# EAGLE design RILey_Schematic (EAGLE 9.6.2)
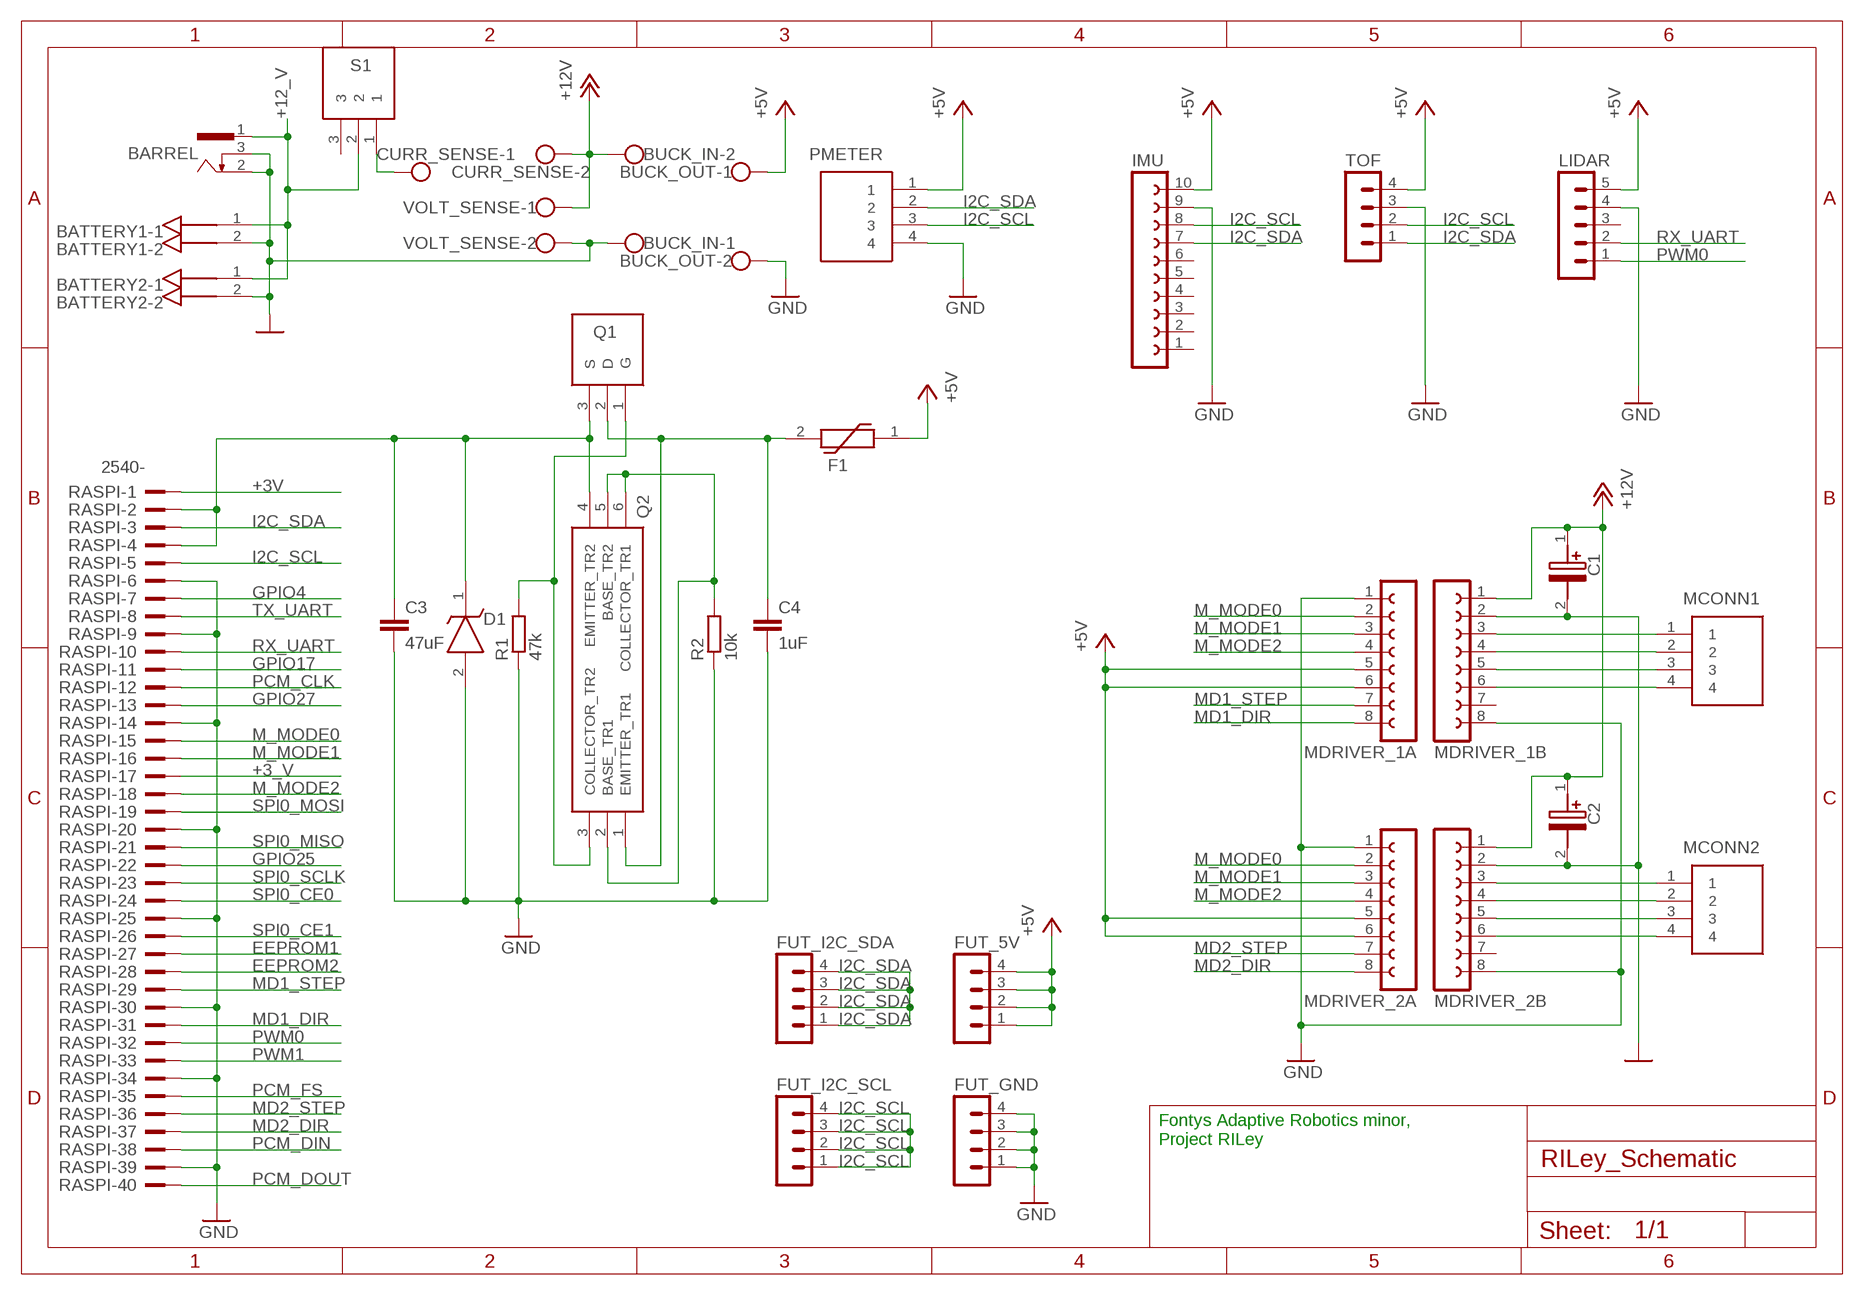
[diagram p0: schematic, sheet 1]

## Parts
BARREL  733980-62  [733980-62]
BATTERY1  0026604020  [KK41791-4020_2-PIN]
BATTERY2  0026604020  [KK41791-4020_2-PIN]
BUCK_IN  W237-102  [W237-102]
BUCK_OUT  W237-102  [W237-102]
C1  100uF  UPS1E101MED  [CAPPRD250W50D655H1250]
C2  100uF  UPS1E101MED  [CAPPRD250W50D655H1250]
C3  47uF  C5/2.5  [C5B2.5]
C4  1uF  C2,5-3  [C2.5-3]
CURR_SENSE  W237-102  [W237-102]
D1  SA5.0A-E3_54  [DIOAD1910W86L670D310]
F1  PTS18126V260  [FUSC4632X90N]
FUT_5V  MA04-1  [MA04-1]
FUT_GND  MA04-1  [MA04-1]
FUT_I2C_SCL  MA04-1  [MA04-1]
FUT_I2C_SDA  MA04-1  [MA04-1]
IMU  FE10-1  [FE10]
LIDAR  MA05-1  [MA05-1]
MCONN1  B4B-XH-A_LF__SN_  [SHDR4W64P0X250_1X4_1240X575X70]
MCONN2  B4B-XH-A_LF__SN_  [SHDR4W64P0X250_1X4_1240X575X70]
MDRIVER_1A  FE08-1  [FE08]
MDRIVER_1B  FE08-1  [FE08]
MDRIVER_2A  FE08-1  [FE08]
MDRIVER_2B  FE08-1  [FE08]
PMETER  BLG1X4  [RHDR4W64P0X254_1X4_1066X250X86]
Q1  IRF9530NPBF  [TO254P469X1042X1967-3P]
Q2  BCM857BS,115  [SOT65P210X110-6N]
R1  47k  R-EU_0207/10  [0207/10]
R2  10k  R-EU_0207/10  [0207/10]
RASPI  2540-  [PAK100/2500-40]
S1  1101M2S3CQE2  [1000-SERIES(SPDT)]
TOF  MA04-1  [MA04-1]
VOLT_SENSE  W237-102  [W237-102]

## Nets
0V [Power]: BARREL.2 BARREL.3 BATTERY1.2 BATTERY2.2 BUCK_IN.1 C1.2(-) C2.2(-) MDRIVER_1B.2 MDRIVER_2B.2 VOLT_SENSE.2
+3_V: RASPI.17
+3V: RASPI.1
+5V [Power]: BUCK_OUT.1 F1.1 FUT_5V.1 FUT_5V.2 FUT_5V.3 FUT_5V.4 IMU.10 LIDAR.5 MDRIVER_1A.5 MDRIVER_1A.6 MDRIVER_2A.5 MDRIVER_2A.6 PMETER.1 TOF.4
+12_V [Power]: BARREL.1 BATTERY1.1 BATTERY2.1 S1.2
+12V [Power]: BUCK_IN.2 C1.1(+) C2.1(+) CURR_SENSE.2 MDRIVER_1B.1 MDRIVER_2B.1 VOLT_SENSE.1
EEPROM1: RASPI.27
EEPROM2: RASPI.28
GND [Power]: BUCK_OUT.2 C3.2 C4.2 D1.2(A) FUT_GND.1 FUT_GND.2 FUT_GND.3 FUT_GND.4 IMU.9 LIDAR.4 MDRIVER_1A.1 MDRIVER_1B.8 MDRIVER_2A.1 MDRIVER_2B.8 PMETER.4 R1.1 R2.1 RASPI.6 RASPI.9 RASPI.14 RASPI.20 RASPI.25 RASPI.30 RASPI.34 RASPI.39 TOF.3
GPIO4: RASPI.7
GPIO17: RASPI.11
GPIO25: RASPI.22
GPIO27: RASPI.13
I2C_SCL: FUT_I2C_SCL.1 FUT_I2C_SCL.2 FUT_I2C_SCL.3 FUT_I2C_SCL.4 IMU.8 PMETER.3 RASPI.5 TOF.2
I2C_SDA: FUT_I2C_SDA.1 FUT_I2C_SDA.2 FUT_I2C_SDA.3 FUT_I2C_SDA.4 IMU.7 PMETER.2 RASPI.3 TOF.1
M_MODE0: MDRIVER_1A.2 MDRIVER_2A.2 RASPI.15
M_MODE1: MDRIVER_1A.3 MDRIVER_2A.3 RASPI.16
M_MODE2: MDRIVER_1A.4 MDRIVER_2A.4 RASPI.18
MD1_DIR: MDRIVER_1A.8 RASPI.31
MD1_STEP: MDRIVER_1A.7 RASPI.29
MD2_DIR: MDRIVER_2A.8 RASPI.37
MD2_STEP: MDRIVER_2A.7 RASPI.36
N$4 [Power]: MCONN1.1 MDRIVER_1B.3
N$5 [Power]: MCONN1.2 MDRIVER_1B.4
N$6 [Power]: MCONN1.3 MDRIVER_1B.5
N$7 [Power]: MCONN1.4 MDRIVER_1B.6
N$8 [Power]: MCONN2.1 MDRIVER_2B.3
N$9 [Power]: MCONN2.2 MDRIVER_2B.4
N$10 [Power]: MCONN2.3 MDRIVER_2B.5
N$11 [Power]: MCONN2.4 MDRIVER_2B.6
N$12: Q1.1(G) Q2.3(COLLECTOR_TR2) R1.2
N$13 [Power]: CURR_SENSE.1 S1.1
N$14 [Power]: C4.1 F1.2 Q1.2(D) Q2.1(EMITTER_TR1)
N$15 [Power]: C3.1 D1.1(K) Q1.3(S) Q2.4(EMITTER_TR2) RASPI.2 RASPI.4
N$16: Q2.2(BASE_TR1) Q2.5(BASE_TR2) Q2.6(COLLECTOR_TR1) R2.2
PCM_CLK: RASPI.12
PCM_DIN: RASPI.38
PCM_DOUT: RASPI.40
PCM_FS: RASPI.35
PWM0: LIDAR.1 RASPI.32
PWM1: RASPI.33
RX_UART: LIDAR.2 RASPI.10
SPI0_CE0: RASPI.24
SPI0_CE1: RASPI.26
SPI0_MISO: RASPI.21
SPI0_MOSI: RASPI.19
SPI0_SCLK: RASPI.23
TX_UART: RASPI.8
Unconnected: IMU.1 IMU.2 IMU.3 IMU.4 IMU.5 IMU.6 LIDAR.3 MDRIVER_1B.7 MDRIVER_2B.7 S1.3

## Notes on the sheet
- Fontys Adaptive Robotics minor,
  Project RILey

## Library data of the parts
BARREL = con-conrad:73398?: FEMALE PRINT CONNECTOR Niedervolt-Steckverbinder Distributor Conrad
BATTERY1 BATTERY2 = molex:0026604020: KK® 396 Header, Vertical, Friction Lock, 2 Circuits, Tin (Sn) Plating KK® Interconnect System Documentation Drawing <http://www.molex.com/pdm_docs/sd/026604020_sd.pdf>; CATEGORY: Connectors, Interconnects; COLOR: Natural; CONNECTOR_TYPE: Header, Unshrouded; CONTACT_FINISH: Tin; CONTACT_FINISH_THICKNESS: 60µin (1.52µm); CONTACT_MATING_LENGTH: 0.450" (11.43mm); CONTACT_TYPE: Male Pin; DESCRIPTION: CONN HEADER 2POS .156 VERT TIN; DOCUMENTATION_LINK: <a href="http://www.molex.com/pdm_docs/sd/026604020_sd.pdf">Datasheet</a>; DOCUMENTATION_URL: http://www.molex.com/pdm_docs/sd/026604020_sd.pdf; FAMILY: Rectangular Connectors - Headers, Male Pins; FASTENING_TYPE: Friction Lock; FEATURES: -; MANUFACTURER: Molex Inc; MOUNTING_TYPE: Through Hole; NUMBER_OF_POSITIONS: 2; NUMBER_OF_POSITIONS_LOADED: All; NUMBER_OF_ROWS: 1; PART_NUMBER: 0026604020; PITCH: 0.156" (3.96mm); ROW_SPACING: -; SERIES: KK® 41791; SUPPLIER_ITEM_LINK: <a href="http://www.digikey.com/product-search/en?KeyWords=0026604020&WT.z_header=search_go">Details</a>; SUPPLIER_ITEM_NUMBER: WM4620-ND; SUPPLIER_ITEM_URL: http://www.digikey.com/product-search/en?KeyWords=0026604020&WT.z_header=search_go; SUPPLIER_LINK: <a href="http://www.digikey.com">Home Page</a>; SUPPLIER_NAME: Digi-Key; SUPPLIER_URL: http://www.digikey.com; TERMINATION: Solder
BUCK_IN BUCK_OUT CURR_SENSE VOLT_SENSE = con-wago-500:W237-102: WAGO SCREW CLAMP; MPN: 237-102; OC_FARNELL: unknown; OC_NEWARK: 70K9898
C1 C2 = UPS1E101MED:UPS1E101MED: Al electrolytic cap,PS,25V,100 F Nichicon 100uF 25 V dc Aluminium Electrolytic Capacitor, PS Series 2000h 6.3 (Dia.) x 11mm Source: Datasheet <http://uk.rs-online.com/web/p/products/5194059P>; ALLIED_NUMBER: 70187653; DESCRIPTION: Al electrolytic cap,PS,25V,100 F Nichicon 100uF 25 V dc Aluminium Electrolytic Capacitor, PS Series 2000h 6.3 (Dia.) x 11mm; HEIGHT: 12.5mm; MANUFACTURER_NAME: Nichicon; MANUFACTURER_PART_NUMBER: UPS1E101MED; RS_PART_NUMBER: 5194059P; RS_PRICE-STOCK: http://uk.rs-online.com/web/p/products/5194059P
C3 C4 = capacitor-wima:C: CAPACITOR naming: grid - package width
D1 = SamacSys_Parts:SA5.0A-E3_54: Vishay SA5.0A-E3/54, Uni-Directional TVS Diode, 500W, 2-Pin DO-15 Source: Datasheet <http://uk.rs-online.com/web/p/products/6365527P>; ALLIED_NUMBER: 70217602; DESCRIPTION: Vishay SA5.0A-E3/54, Uni-Directional TVS Diode, 500W, 2-Pin DO-15; HEIGHT: mm; MANUFACTURER_NAME: Vishay; MANUFACTURER_PART_NUMBER: SA5.0A-E3/54; RS_PART_NUMBER: 6365527P; RS_PRICE-STOCK: http://uk.rs-online.com/web/p/products/6365527P
F1 = PTS1812xVxxx:PTS18126V260: PTC Resettable Fuse 2.6A(hold) 5A(trip) 6VDC 100A 1.2W 2.5s 0.015Ohm SMD Solder Pad 1812 T/R Source: Datasheet <https://datasheet.datasheetarchive.com/originals/dk/DKDS41/DSANUWW0021568.pdf>; DESCRIPTION: PTC Resettable Fuse 2.6A(hold) 5A(trip) 6VDC 100A 1.2W 2.5s 0.015Ohm SMD Solder Pad 1812 T/R; HEIGHT: 0.9mm; MANUFACTURER_NAME: Eaton; MANUFACTURER_PART_NUMBER: PTS18126V260
FUT_5V FUT_GND FUT_I2C_SCL FUT_I2C_SDA TOF = con-lstb:MA04-1: PIN HEADER; OC_FARNELL: unknown; OC_NEWARK: unknown
IMU = con-lsta:FE10-1: FEMALE HEADER; OC_FARNELL: unknown; OC_NEWARK: unknown
LIDAR = con-lstb:MA05-1: PIN HEADER; OC_FARNELL: unknown; OC_NEWARK: unknown
MCONN1 MCONN2 = SamacSys_Parts:B4B-XH-A_LF__SN_: XH-2.5mm Header top entry 4 way JST XH Series, Series Number B4B, 2.5mm Pitch 4 Way 1 Row Straight PCB Header, Solder Termination, 3A Source: Datasheet; DESCRIPTION: XH-2.5mm Header top entry 4 way JST XH Series, Series Number B4B, 2.5mm Pitch 4 Way 1 Row Straight PCB Header, Solder Termination, 3A; HEIGHT: 7mm; MANUFACTURER_NAME: JST (JAPAN SOLDERLESS TERMINALS); MANUFACTURER_PART_NUMBER: B4B-XH-A(LF)(SN)
MDRIVER_1A MDRIVER_1B MDRIVER_2A MDRIVER_2B = con-lsta:FE08-1: FEMALE HEADER; OC_FARNELL: unknown; OC_NEWARK: unknown
PMETER = BLG1X4:BLG1X4: Female header 1x4 p straight Source: Datasheet <https://asset.conrad.com/media10/add/160267/c1/-/en/001492285DS01/datasheet-1492285-econ-connect-receptacles-standard-no-of-rows-1-pins-per-row-4-blg1x4-1-pcs.pdf>; DESCRIPTION: Female header 1x4 p straight; HEIGHT: 8.65mm; MANUFACTURER_NAME: Econ Connect; MANUFACTURER_PART_NUMBER: BLG1X4
Q1 = SamacSys_Parts:IRF9530NPBF: MOSFET MOSFT PCh -100V -14A 200mOhm 38.7nC Source: Datasheet <http://china.rs-online.com/web/p/products/2509059275>; ALLIED_NUMBER: 70017011; DESCRIPTION: MOSFET MOSFT PCh -100V -14A 200mOhm 38.7nC; HEIGHT: 4.69mm; MANUFACTURER_NAME: Infineon; MANUFACTURER_PART_NUMBER: IRF9530NPBF; RS_PART_NUMBER: 2509059275; RS_PRICE-STOCK: http://china.rs-online.com/web/p/products/2509059275
Q2 = SamacSys_Parts:BCM857BS,115: Nexperia BCM857BS,115 Dual PNP Transistor, 100 mA, 45 V, 6-Pin UMT Source: Datasheet <http://uk.rs-online.com/web/p/products/0509706>; DESCRIPTION: Nexperia BCM857BS,115 Dual PNP Transistor, 100 mA, 45 V, 6-Pin UMT; HEIGHT: 1.1mm; MANUFACTURER_NAME: Nexperia; MANUFACTURER_PART_NUMBER: BCM857BS,115; RS_PART_NUMBER: 0509706; RS_PRICE-STOCK: http://uk.rs-online.com/web/p/products/0509706
R1 R2 = rcl:R-EU_: RESISTOR, European symbol; SPICEPREFIX: R
RASPI = con-3m:2540-: 3M (TM) Pak 100 4-Wall Header Source: 3M; OC_FARNELL: unknown; OC_NEWARK: unknown
S1 = SamacSys_Parts:1101M2S3CQE2: 1101M2S3CQE2 (Slide Switches) Source: Datasheet <http://uk.rs-online.com/web/p/products/1617340>; ALLIED_NUMBER: 70128282; DESCRIPTION: 1101M2S3CQE2 (Slide Switches); HEIGHT: mm; MANUFACTURER_NAME: C & K COMPONENTS; MANUFACTURER_PART_NUMBER: 1101M2S3CQE2; RS_PART_NUMBER: 1617340; RS_PRICE-STOCK: http://uk.rs-online.com/web/p/products/1617340

## Net classes
1 Power: width 0.508 mm, clearance 0.381 mm

## Board
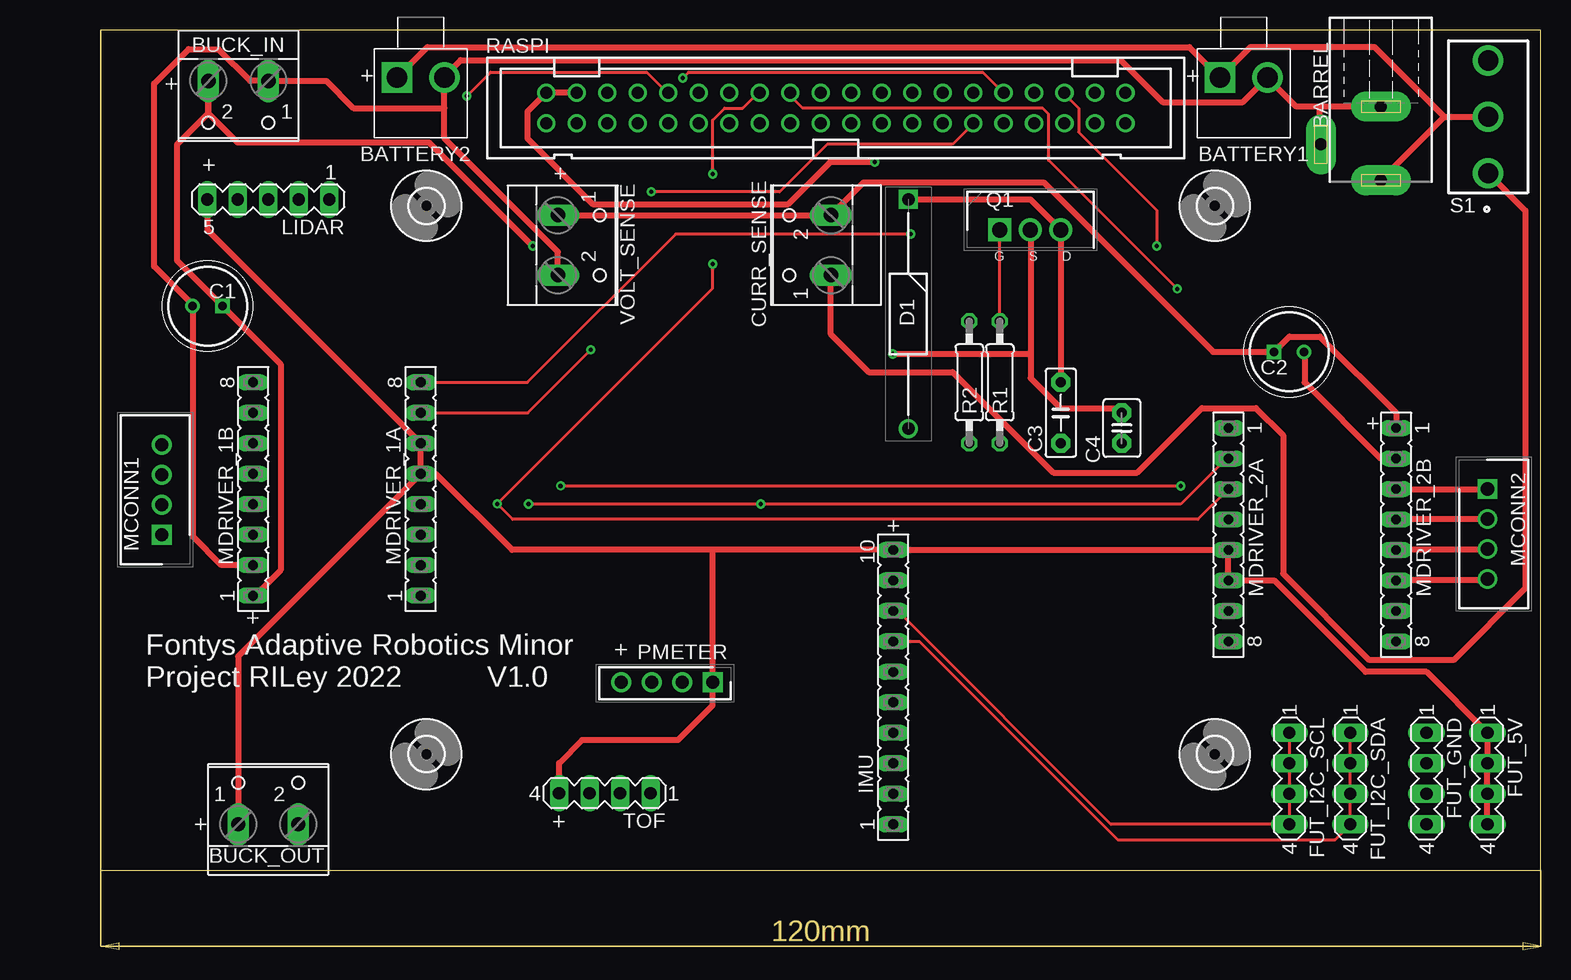
[diagram p1: board, top side]
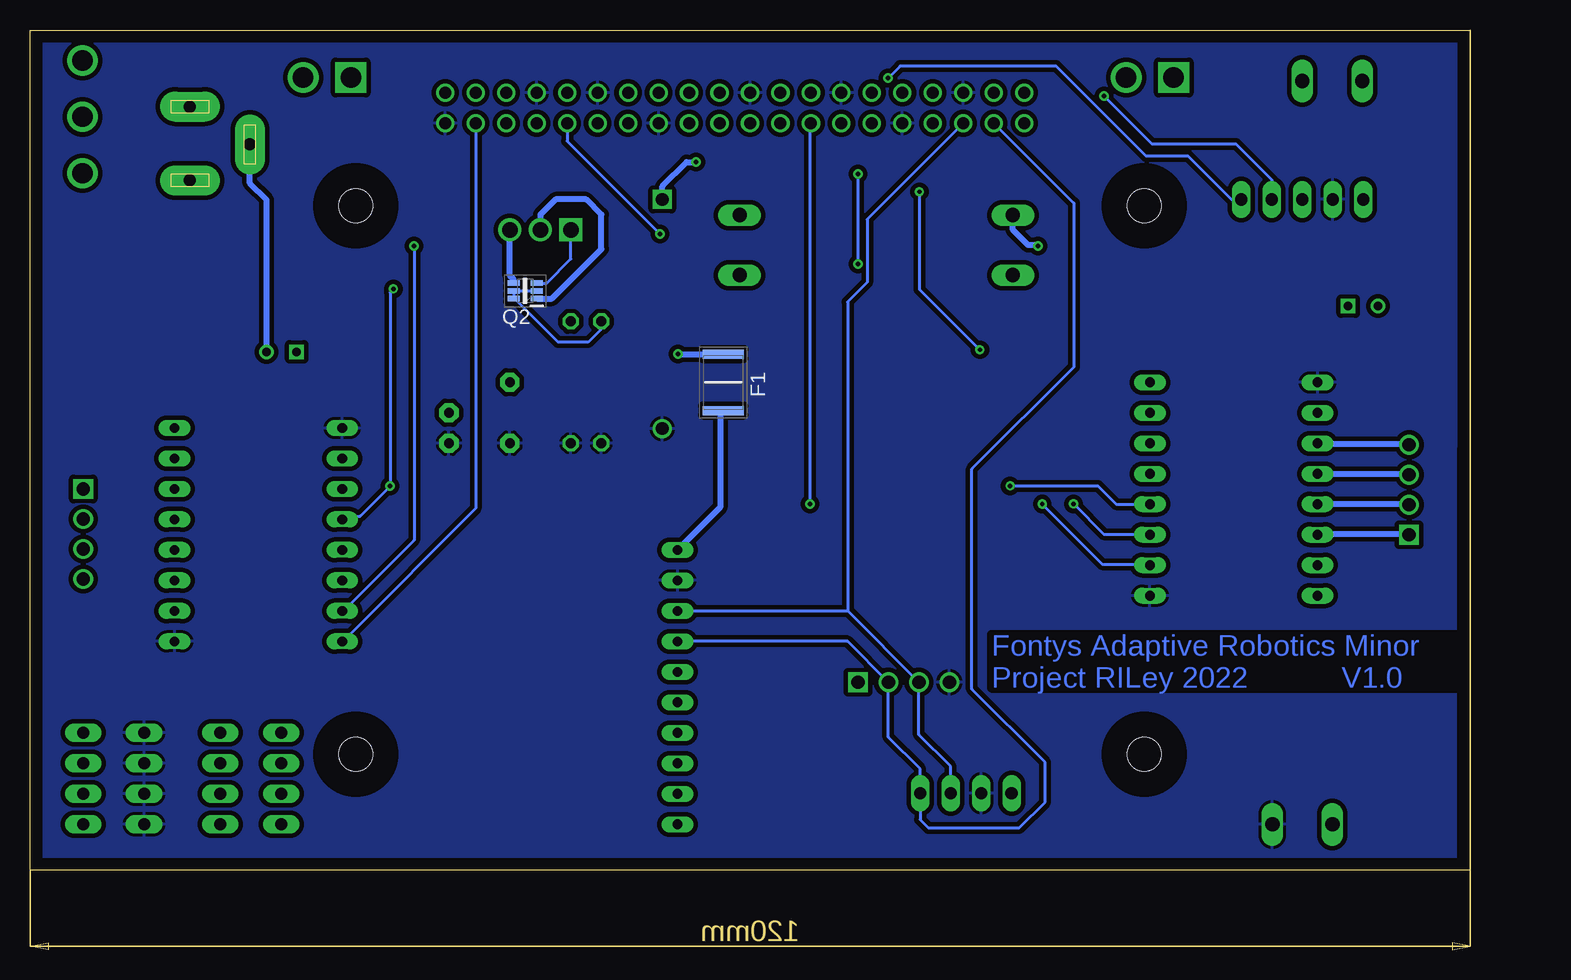
[diagram p2: board, bottom side, seen from below]

Size 120 x 70 mm. Coordinates in mm from the lower left corner, seen from the top.
Outline: 0,0 120,0 120,70 0,70 0,0
Copper layers (1*16): Top 0.035mm / dielectric 1.5mm / Bottom 0.035mm
Design rules "default *": minimum track width 10mil, minimum drill 0.35mm, track to track 10mil, track to pad 10mil, pad to pad 10mil, via to via 10mil, smd to smd 10mil, copper to edge 40mil, drill to drill 6mil, minimum pad ring 10mil, minimum via ring 8mil, stop-mask expansion 4mil, vias tented up to drill 0mil, thermal gap 10mil

### Footprints (pad centres in the part's own frame; a part is rotated, then mirrored left to right if it is on the bottom)
733980-62 = drill 1 pad 2.5 long: 1 0,8.57; 2 0,2.42; 3 5,5.57
KK41791-4020_2-PIN = drill 1.707 square: 1 -1.981,0 | drill 1.707: 2 1.981,0
W237-102 = drill 1.194 long: 1 -2.5,-1.27; 2 2.5,-1.27
CAPPRD250W50D655H1250 = drill 0.7 pad 1.1 square: 1 0,0 | drill 0.7 pad 1.1: 2 2.5,0
C5B2.5 = drill 0.813 pad 1.6 octagon: 1 -2.54,0; 2 2.54,0
C2.5-3 = drill 0.813 pad 1.6 octagon: 1 -1.27,0; 2 1.27,0
DIOAD1910W86L670D310 = drill 1.05 pad 1.575 square: 1 0,0 | drill 1.05 pad 1.575: 2 19.1,0
FUSC4632X90N = smd 0.75 x 3.43: 1 -2.35,0; 2 2.35,0
MA04-1 = drill 1.016 long: 1 -3.81,0; 2 -1.27,0; 3 1.27,0; 4 3.81,0
FE10 = drill 0.813 long: 1 -11.43,0; 2 -8.89,0; 3 -6.35,0; 4 -3.81,0; 5 -1.27,0; 6 1.27,0; 7 3.81,0; 8 6.35,0; 9 8.89,0; 10 11.43,0
MA05-1 = drill 1.016 long: 1 -5.08,0; 2 -2.54,0; 3 0,0; 4 2.54,0; 5 5.08,0
SHDR4W64P0X250_1X4_1240X575X70 = drill 1.1 pad 1.65 square: 1 0,0 | drill 1.1 pad 1.65: 2 2.5,0; 3 5,0; 4 7.5,0
FE08 = drill 0.813 long: 1 -8.89,0; 2 -6.35,0; 3 -3.81,0; 4 -1.27,0; 5 1.27,0; 6 3.81,0; 7 6.35,0; 8 8.89,0
RHDR4W64P0X254_1X4_1066X250X86 = drill 1.1 pad 1.65 square: 1 0,0 | drill 1.1 pad 1.65: 2 2.54,0; 3 5.08,0; 4 7.62,0
TO254P469X1042X1967-3P = drill 1.28 pad 1.92 square: 1 0,0 | drill 1.28 pad 1.92: 2 2.54,0; 3 5.08,0
SOT65P210X110-6N = smd 1 x 0.45: 1 -0.95,0.65; 2 -0.95,0; 3 -0.95,-0.65; 4 0.95,-0.65; 5 0.95,0; 6 0.95,0.65
0207/10 = drill 0.813 octagon: 1 -5.08,0; 2 5.08,0
PAK100/2500-40 = drill 1 pad 1.422: 1 -24.13,-1.27; 2 -24.13,1.27; 3 -21.59,-1.27; 4 -21.59,1.27; 5 -19.05,-1.27; 6 -19.05,1.27; 7 -16.51,-1.27; 8 -16.51,1.27; 9 -13.97,-1.27; 10 -13.97,1.27; 11 -11.43,-1.27; 12 -11.43,1.27; 13 -8.89,-1.27; 14 -8.89,1.27; 15 -6.35,-1.27; 16 -6.35,1.27; 17 -3.81,-1.27; 18 -3.81,1.27; 19 -1.27,-1.27; 20 -1.27,1.27; 21 1.27,-1.27; 22 1.27,1.27; 23 3.81,-1.27; 24 3.81,1.27; 25 6.35,-1.27; 26 6.35,1.27; 27 8.89,-1.27; 28 8.89,1.27; 29 11.43,-1.27; 30 11.43,1.27; 31 13.97,-1.27; 32 13.97,1.27; 33 16.51,-1.27; 34 16.51,1.27; 35 19.05,-1.27; 36 19.05,1.27; 37 21.59,-1.27; 38 21.59,1.27; 39 24.13,-1.27; 40 24.13,1.27
1000-SERIES(SPDT) = drill 1.68 pad 2.48: 1 0,-4.7; 2 0,0; 3 0,4.7
2,8 = hole 2.8: 0,0

### Placement (x,y rotation side)
BARREL  106.68,66.04 180 top
BATTERY1  95.25,66.04 0 top
BATTERY2  26.67,66.04 0 top
BUCK_IN  11.48,64.49 180 top
BUCK_OUT  13.97,5.08 0 top
C1  10.16,46.99 180 top
C2  97.79,43.18 0 top
C3  80.01,38.1 270 top
C4  85.09,36.83 270 top
CURR_SENSE  59.59,52.07 90 top
D1  67.31,55.88 270 top
F1  62.23,40.64 90 bottom
FUT_5V  115.57,7.62 270 top
FUT_GND  110.49,7.62 270 top
FUT_I2C_SCL  99.06,7.62 270 top
FUT_I2C_SDA  104.14,7.62 270 top
IMU  66.04,15.24 90 top
LIDAR  13.97,55.88 180 top
MCONN1  5.08,27.94 90 top
MCONN2  115.57,31.75 270 top
MDRIVER_1A  26.67,31.75 90 top
MDRIVER_1B  12.7,31.75 90 top
MDRIVER_2A  93.98,27.94 270 top
MDRIVER_2B  107.95,27.94 270 top
PMETER  51,15.65 180 top
Q1  74.93,53.34 0 top
Q2  78.74,48.26 180 bottom
R1  74.93,40.64 90 top
R2  72.39,40.64 90 top
RASPI  61.27,63.5 0 top
S1  115.62,62.76 0 top
TOF  42.01,6.4 180 top
U$1  [2,8]  27.15,9.65 0 top
U$3  [2,8]  92.85,55.35 0 top
U$4  [2,8]  27.15,55.35 0 top
U$5  [2,8]  92.85,9.65 0 top
VOLT_SENSE  39.37,52.07 270 top

### Tracks (layer width: path | path; a pad name or v marks a point on that pad's centre or on a via)
0V
  Top 0.508: BARREL.2 101.6,63.62 | 101.6,63.62 99.65,63.62 BATTERY1.2 95.19,64 88.5,64 85,67.5 30,67.5 29,66.5 BATTERY2.2 28.65,63.5 | BARREL.3 101.6,60.55 101.6,63.62 | C2.2 100.33,43.14 100.33,40.64 106.68,34.29 MDRIVER_2B.2 | MDRIVER_1B.2 10.06,25.4 7.66,27.8 C1.2 7.66,47.09 4.46,50.29 4.46,65.52 7.34,68.4 9.8,68.4 12.45,65.76 BUCK_IN.1 18.81,65.76 21.07,63.5 28.65,63.5 | 28.65,63.5 28.65,60.96 38.1,51.51 VOLT_SENSE.2
  Bottom 0.508: C2.2 100.29,55.84 101.68,57.23 BARREL.3
+5V
  Top 0.508: FUT_5V.4 FUT_5V.3 FUT_5V.2 FUT_5V.1 110.49,16.51 105.41,16.51 97.79,24.13 MDRIVER_2A.6 MDRIVER_2A.5 IMU.10 51,26.67 | BUCK_OUT.1 11.45,3.83 11.45,17.8 MDRIVER_1A.5 | TOF.4 38.2,8.91 40.13,10.85 48.13,10.85 51,13.72 PMETER.1 51,26.67 | 51,26.67 34.29,26.67 27.94,33.02 MDRIVER_1A.5 | MDRIVER_1A.5 MDRIVER_1A.6 8.89,53.34 LIDAR.5
  Bottom 0.508: F1.1 62.5,38 62.5,30.21 IMU.10
+12_V
  Top 0.508: BATTERY2.1 27.23,68.58 90.73,68.58 BATTERY1.1 95.81,68.58 106.16,68.58 111.97,62.76 | BARREL.1 111.97,62.76 | 111.97,62.76 S1.2
+12V  (via drill 0.35)
  Top 0.508: MDRIVER_1B.1 13,23 15,25 15,42.15 C1.1 6.35,50.8 6.35,60.43 8.98,63.06 BUCK_IN.2 8.98,63.04 11.41,60.62 27.38,60.62 v36,52 | MDRIVER_2B.1 107.95,38.1 101.6,44.45 99.06,44.45 C2.1 92.71,43.18 78.59,57.3 63.59,57.3 CURR_SENSE.2 VOLT_SENSE.1
  Bottom 0.508: v36,52 36.07,52.07 36.83,52.07 38.1,53.34 VOLT_SENSE.1
GND
  pour Bottom: 0,69.98 0,0 120.02,0 120.02,69.98
I2C_SCL
  Top 0.254: FUT_I2C_SCL.1 FUT_I2C_SCL.2 FUT_I2C_SCL.3 FUT_I2C_SCL.4 84.19,3.81 66.41,21.59 IMU.8
  Bottom 0.254: IMU.8 51.87,21.59 | 51.87,21.59 PMETER.3 45.92,11.28 43.28,8.64 TOF.2 | 51.87,21.59 51.87,47.34 50.24,48.97 50.24,54.21 RASPI.5
I2C_SDA
  Top 0.254: FUT_I2C_SDA.1 FUT_I2C_SDA.2 FUT_I2C_SDA.3 FUT_I2C_SDA.4 102.87,2.54 84.74,2.54 68.23,19.05 IMU.7
  Bottom 0.254: RASPI.3 33.02,55.57 33.02,41.91 41.5,33.43 41.5,15.06 35.41,8.97 35.41,5.66 37.57,3.5 45.14,3.5 45.82,4.19 TOF.1 45.82,8.43 48.46,11.07 PMETER.2 51.87,19.05 IMU.7
M_MODE0  (via drill 0.35)
  Top 0.254: v35.65,30.5 v55,30.5 90,30.5 93.5,34 MDRIVER_2A.2
  Bottom 0.254: v35.65,30.5 30.65,25.5 27,25.5 MDRIVER_1A.2 | v55,30.5 55,62 RASPI.15
M_MODE1  (via drill 0.35)
  Top 0.254: v51,58 51,62.5 52,63.5 53.5,63.5 54.5,64.5 RASPI.16 | MDRIVER_2A.3 91.44,29.21 34.34,29.21 v33.04,30.51 51,48.47 v51,50.5
  Bottom 0.254: v33.04,30.51 30.53,28 27,28 MDRIVER_1A.3 | v51,50.5 v51,58
M_MODE2  (via drill 0.35)
  Top 0.254: v90,32 v38.33,32 v38.33,32.01 | v89.71,48.42 79,59.13 79,63 78.5,63.5 58.5,63.5 57.5,64.5 RASPI.18
  Bottom 0.254: v38.33,32.01 31.01,32.01 29.5,30.5 27,30.5 MDRIVER_1A.4 | MDRIVER_2A.4 93.5,29.5 92.5,29.5 v90,32 90,48.13 v89.71,48.42
MD1_DIR  (via drill 0.35)
  Top 0.254: v67.5,53 47.92,53 35.56,40.64 MDRIVER_1A.8
  Bottom 0.254: v67.5,53 75.25,60.75 RASPI.31
MD1_STEP  (via drill 0.35)
  Top 0.254: v45.88,56.52 56.58,56.52 60.57,60.5 71,60.5 72.5,62 RASPI.29 | v40.84,43.35 35.59,38.1 MDRIVER_1A.7
  Bottom 0.254: v45.88,56.52 45.88,48.39 v40.84,43.35
MD2_DIR
  Bottom 0.254: MDRIVER_2A.8 93.5,19.5 82.86,30.14 RASPI.37
MD2_STEP  (via drill 0.35)
  Top 0.254: v88,52 88,55 81.5,61.5 81.5,63.5 80.5,64.5 RASPI.36
  Bottom 0.254: v88,52 88,27.5 93.5,22 MDRIVER_2A.7
N$4
  Bottom 0.508: MDRIVER_1B.3 12.5,28 5.5,28 MCONN1.1
N$5
  Bottom 0.508: MDRIVER_1B.4 12.5,30.5 5.5,30.5 MCONN1.2
N$6
  Bottom 0.508: MDRIVER_1B.5 12.5,33 5.5,33 MCONN1.3
N$7
  Bottom 0.508: MDRIVER_1B.6 12.5,35.5 5.5,35.5 MCONN1.4
N$8
  Top 0.508: MDRIVER_2B.3 MCONN2.1
N$9
  Top 0.508: MCONN2.2 115.53,29.21 MDRIVER_2B.4
N$10
  Top 0.508: MDRIVER_2B.5 108.03,26.75 MCONN2.3
N$11
  Top 0.508: MCONN2.4 115.45,24.13 MDRIVER_2B.6
N$12
  Top 0.254: R1.2 Q1.1
  Bottom 0.254: Q2.3 76.95,48.91 74.93,50.93 Q1.1
N$13
  Top 0.508: CURR_SENSE.1 60.86,44.63 63.99,41.5 71,41.5 79.39,33.11 86.38,33.11 91.77,38.5 96.27,38.5 98.54,36.23 98.54,24.69 105.73,17.5 112.75,17.5 118.73,23.48 118.73,54.95 S1.1
N$14  (via drill 0.35)
  Top 0.508: 77.5,43 77.5,53 Q1.2 | 77.5,43 77.5,41 80,38.5 85,38.5 C4.1 | 77.5,43 v66,43
  Bottom 0.508: v66,43 62.5,43 F1.2 | Q2.1 76.52,47.61 72.39,51.74 72.39,54.61 73.66,55.88 76.2,55.88 77.47,54.61 Q1.2
N$15  (via drill 0.35)
  Top 0.508: C3.1 80,41 80,53 Q1.3 77.47,55.88 D1.1 | v64.5,59 60.8,59 57.3,55.5 41.02,55.5 35.56,60.96 35.56,63.19 RASPI.2 RASPI.4
  Bottom 0.508: Q1.3 80.01,49.53 79.69,49.21 Q2.4 | D1.1 67.31,56.97 65.28,59 v64.5,59
N$16
  Bottom 0.254: R2.2 72,45.5 73.5,44 76,44 79.5,47.5 Q2.6 Q2.5 Q2.2
PWM0  (via drill 0.35)
  Top 0.254: v48.5,66 49,66.5 73.5,66.5 75,65 RASPI.32
  Bottom 0.254: v48.5,66 47.5,67 34.5,67 27,59.5 23.5,59.5 19.5,55.5 LIDAR.1
RX_UART  (via drill 0.35)
  Top 0.254: v30.5,64.5 32.5,66.5 45.5,66.5 47,65 RASPI.10
  Bottom 0.254: v30.5,64.5 26.5,60.5 19.5,60.5 16.5,57.5 16.5,56 LIDAR.2

### Text on the board
Bottom: Fontys Adaptive Robotics Minor / Project RILey 2022 V1.0
tNames: + | + | + | + | + | G S D | + | + | + | + | Fontys Adaptive Robotics Minor / Project RILey 2022 V1.0 | + | +